# EAGLE design jit_pcb_dip (EAGLE 6.6.0)
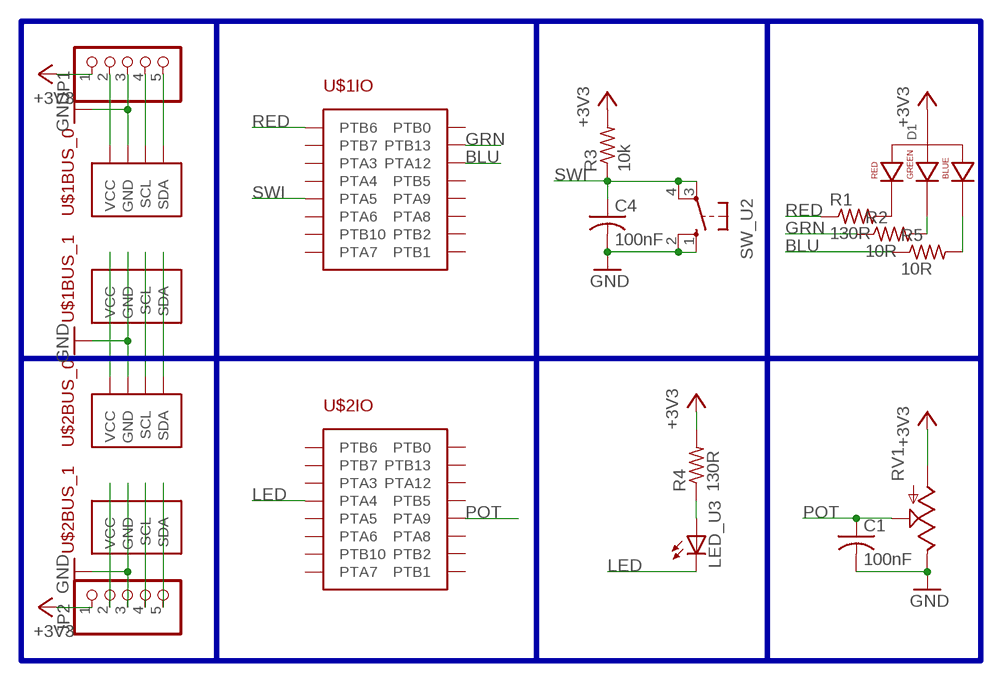
[diagram p0: schematic, sheet 1]

## Parts
C1  100nF  C-US025-025X050  [C025-025X050]
C4  100nF  C-US025-025X050  [C025-025X050]
D1  LED-RGB-CA-THRUDIFFUSE  [LED-RGB-THRU]
JP1  PINHD-1X5  [1X05]
JP2  PINHD-1X5  [1X05]
LED_U3  LED5MM  [LED5MM]
R1  130R  R-US_0204/7  [0204/7]
R2  10R  R-US_0204/7  [0204/7]
R3  10k  R-US_0204/7  [0204/7]
R4  130R  R-US_0204/7  [0204/7]
R5  10R  R-US_0204/7  [0204/7]
RV1  POT100K_3362U  [3362U]
SW_U2  10-XX  [B3F-10XX]
U$1  MODROB_CARRIER-DIP  [CARRIER_DIP]
U$2  MODROB_CARRIER-DIP  [CARRIER_DIP]

## Nets
+3V3: D1.2(ANODE) JP1.1 JP2.1 R3.2 R4.2 RV1.P$3(A)
BLU: R5.1 U$1.PTA12(IO:PTA12)
GND: C1.2 C4.2 JP1.3 JP2.3 RV1.P$1(E) SW_U2.1(S) SW_U2.2(S1) U$1.GND_0(BUS_0:GND) U$1.GND_1(BUS_1:GND) U$2.GND_0(BUS_0:GND) U$2.GND_1(BUS_1:GND)
GRN: R2.1 U$1.PTB13(IO:PTB13)
LED: LED_U3.K(C) U$2.PTA4(IO:PTA4)
N$1: JP1.2 U$1.VCC_0(BUS_0:VCC)
N$2: U$1.VCC_1(BUS_1:VCC) U$2.VCC_0(BUS_0:VCC)
N$3: JP1.4 U$1.SCL_0(BUS_0:SCL)
N$4: LED_U3.A R4.1
N$5: JP1.5 U$1.SDA_0(BUS_0:SDA)
N$6: JP2.2 U$2.VCC_1(BUS_1:VCC)
N$7: U$1.SCL_1(BUS_1:SCL) U$2.SCL_0(BUS_0:SCL)
N$8: U$1.SDA_1(BUS_1:SDA) U$2.SDA_0(BUS_0:SDA)
N$9: JP2.4 U$2.SCL_1(BUS_1:SCL)
N$10: JP2.5 U$2.SDA_1(BUS_1:SDA)
N$13: D1.1(RED_CATHODE) R1.2
N$14: D1.3(GREEN_CATHODE) R2.2
N$15: D1.4(BLUE_CATHODE) R5.2
POT: C1.1 RV1.P$2(S) U$2.PTA9(IO:PTA9)
RED: R1.1 U$1.PTB6(IO:PTB6)
SWI: C4.1 R3.1 SW_U2.3(P) SW_U2.4(P1) U$1.PTA5(IO:PTA5)
Unconnected: U$1.PTA3(IO:PTA3) U$1.PTA4(IO:PTA4) U$1.PTA6(IO:PTA6) U$1.PTA7(IO:PTA7) U$1.PTA8(IO:PTA8) U$1.PTA9(IO:PTA9) U$1.PTB0(IO:PTB0) U$1.PTB1(IO:PTB1) U$1.PTB2(IO:PTB2) U$1.PTB5(IO:PTB5) U$1.PTB7(IO:PTB7) U$1.PTB10(IO:PTB10) U$2.PTA3(IO:PTA3) U$2.PTA5(IO:PTA5) U$2.PTA6(IO:PTA6) U$2.PTA7(IO:PTA7) U$2.PTA8(IO:PTA8) U$2.PTA12(IO:PTA12) U$2.PTB0(IO:PTB0) U$2.PTB1(IO:PTB1) U$2.PTB2(IO:PTB2) U$2.PTB5(IO:PTB5) U$2.PTB6(IO:PTB6) U$2.PTB7(IO:PTB7) U$2.PTB10(IO:PTB10) U$2.PTB13(IO:PTB13)

## Buses
B$1

## Library data of the parts
C1 C4 = rcl:C-US: CAPACITOR, American symbol
D1 = modular_robotics:LED-RGB-CA-THRU: RGB Through-hole common anode SparkFun store front COM-10821 (diffuse) COM-10820 (clear); PROD_ID: DIO-10632
JP1 JP2 = pinhead:PINHD-1X5: PIN HEADER
LED_U3 = led:LED: LED OSRAM: - CHIPLED LG R971, LG N971, LY N971, LG Q971, LY Q971, LO R971, LY R971 LH N974, LH R974 LS Q976, LO Q976, LY Q976 LO Q996 - Hyper CHIPLED LW Q18S LB Q993, LB Q99A, LB R99A - SideLED LS A670, LO A670, LY A670, LG A670, LP A670 LB A673, LV A673, LT A673, LW A673 LH A674 LY A675 LS A676, LA A676, LO A676, LY A676, LW A676 LS A679, LY A679, LG A679 - Hyper Micro SIDELED® LS Y876, LA Y876, LO Y876, LY Y876 LT Y87S - SmartLED LW L88C, LW L88S LB L89C, LB L89S, LG L890 LS L89K, LO L89K, LY L89K LS L896, LA L896, LO L896, LY L896 - TOPLED LS T670, LO T670, LY T670, LG T670, LP T670 LSG T670, LSP T670, LSY T670, LOP T670, LYG T670 LG T671, LOG T671, LSG T671 LB T673, LV T673, LT T673, LW T673 LH T674 LS T676, LA T676, LO T676, LY T676, LB T676, LH T676, LSB T676, LW T676 LB T67C, LV T67C, LT T67C, LS T67K, LO T67K, LY T67K, LW E67C LS E67B, LA E67B, LO E67B, LY E67B, LB E67C, LV E67C, LT E67C LW T67C LS T679, LY T679, LG T679 LS T770, LO T770, LY T770, LG T770, LP T770 LB T773, LV T773, LT T773, LW T773 LH T774 LS E675, LA E675, LY E675, LS T675 LS T776, LA T776, LO T776, LY T776, LB T776 LHGB T686 LT T68C, LB T68C - Hyper Mini TOPLED® LB M676 - Mini TOPLED Santana® LG M470 LS M47K, LO M47K, LY M47K Source: http://www.osram.convergy.de LUXEON: - LUMILED® LXK2-PW12-R00, LXK2-PW12-S00, LXK2-PW14-U00, LXK2-PW14-V00 LXK2-PM12-R00, LXK2-PM12-S00, LXK2-PM14-U00 LXK2-PE12-Q00, LXK2-PE12-R00, LXK2-PE12-S00, LXK2-PE14-T00, LXK2-PE14-U00 LXK2-PB12-K00, LXK2-PB12-L00, LXK2-PB12-M00, LXK2-PB14-N00, LXK2-PB14-P00, LXK2-PB14-Q00 LXK2-PR12-L00, LXK2-PR12-M00, LXK2-PR14-Q00, LXK2-PR14-R00 LXK2-PD12-Q00, LXK2-PD12-R00, LXK2-PD12-S00 LXK2-PH12-R00, LXK2-PH12-S00 LXK2-PL12-P00, LXK2-PL12-Q00, LXK2-PL12-R00 Source: www.luxeon.com KINGBRIGHT: KA-3528ASYC Source: www.kingbright.com
R1-R5 = rcl:R-US_: RESISTOR, American symbol
RV1 = SparkFun-Electromechanical:POT
SW_U2 = switch-omron:10-XX: OMRON SWITCH; MPN: B3F-1000; OC_FARNELL: 176432; OC_NEWARK: 36M3542
U$1 U$2 = modular_robotics:MODROB_CARRIER

## Board
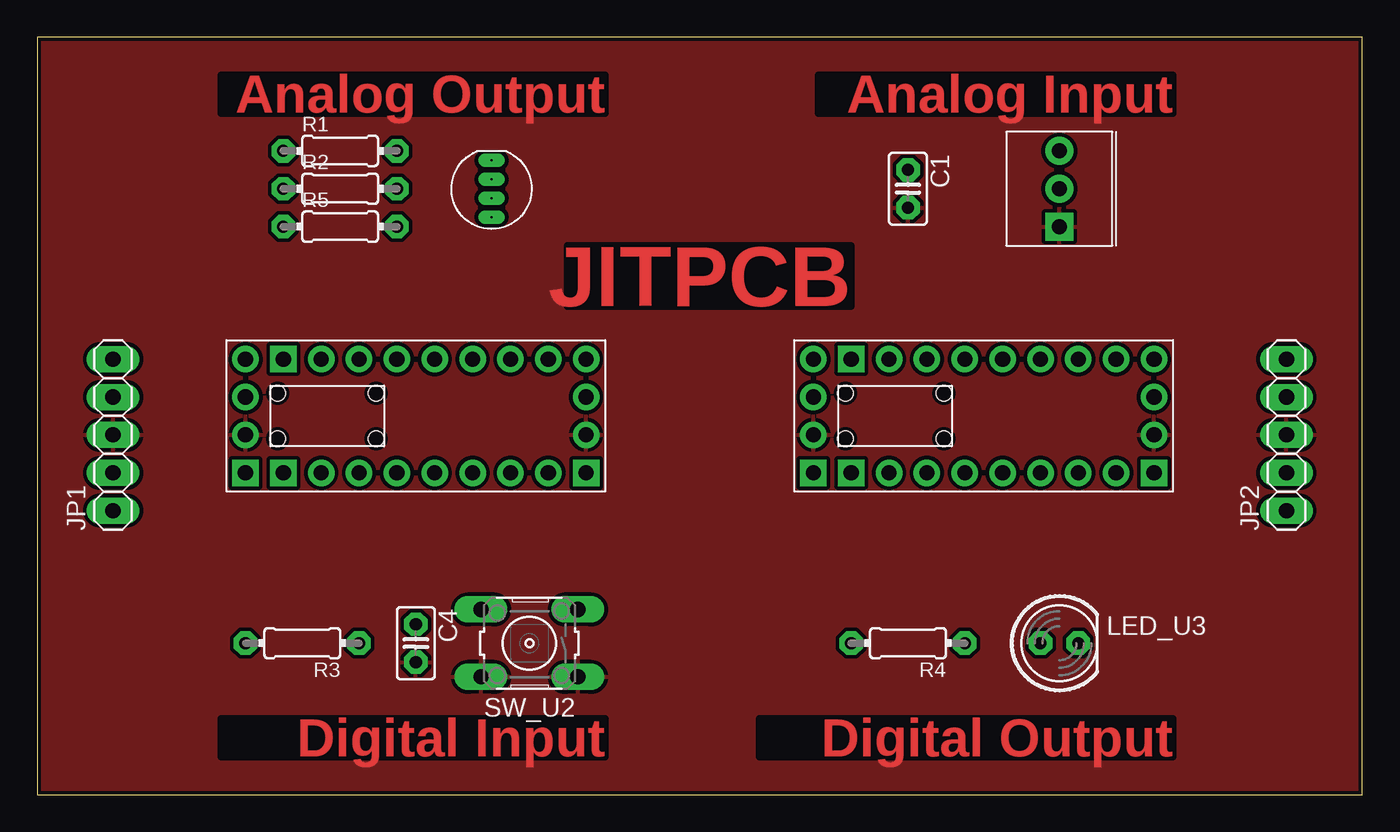
[diagram p1: board, top side]
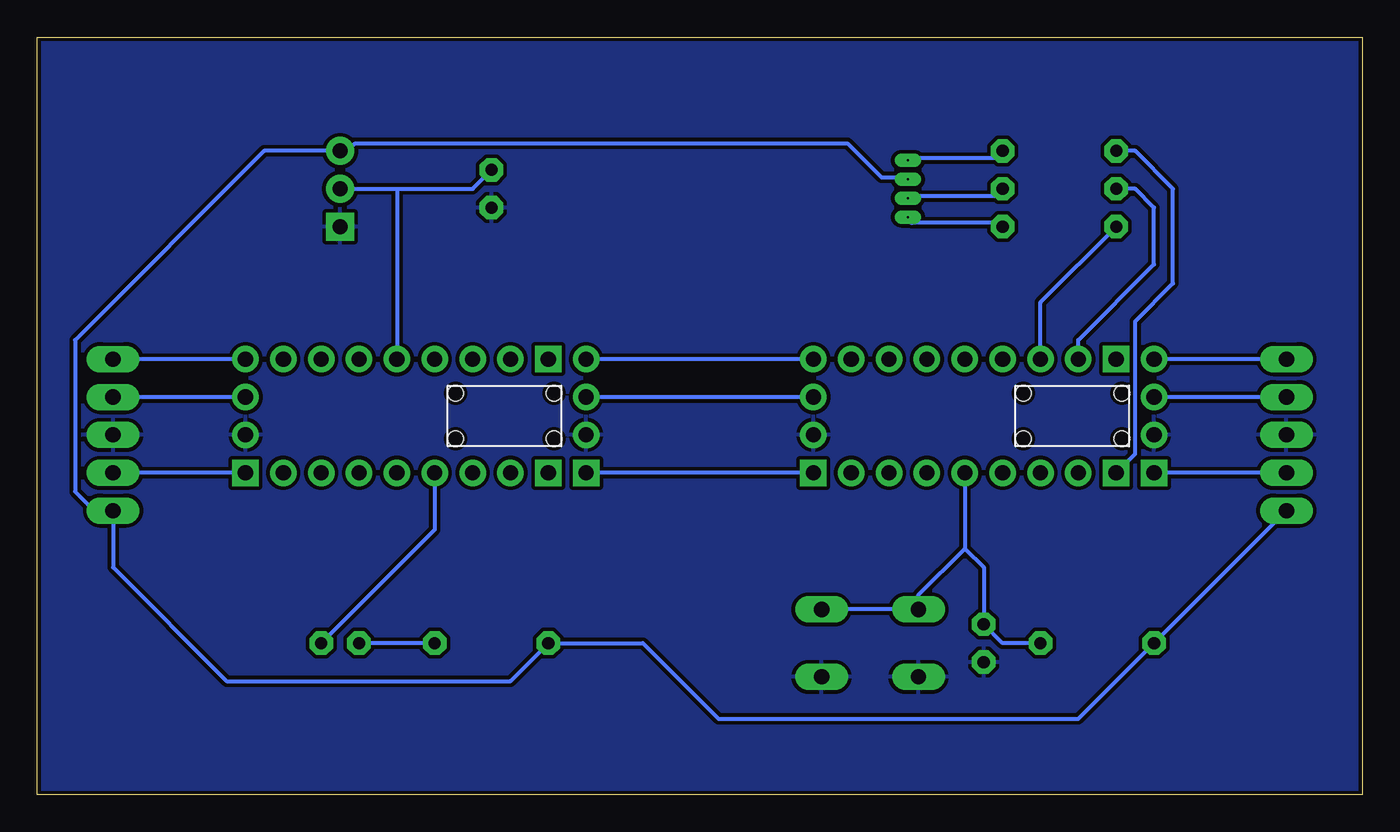
[diagram p2: board, bottom side, seen from below]

Size 88.9 x 50.8 mm. Coordinates in mm from the lower left corner, seen from the top.
Outline: 88.9,0 88.9,50.8 0,50.8 0,0 88.9,0
Copper layers (1*16): Top 0.035mm / dielectric 1.5mm / Bottom 0.035mm
Design rules "default *": minimum track width 10mil, minimum drill 24mil, track to track 10mil, track to pad 10mil, pad to pad 10mil, via to via 10mil, smd to smd 10mil, copper to edge 10mil, drill to drill 8mil, minimum pad ring 15mil, minimum via ring 10mil, stop-mask expansion 4mil, vias tented up to drill 0mil, thermal gap 10mil
Holes 1.02 mm at 16.13,23.88 16.13,26.92 22.73,23.88 22.73,26.92 54.23,23.88 54.23,26.92 60.83,23.88 60.83,26.92

### Footprints (pad centres in the part's own frame; a part is rotated, then mirrored left to right if it is on the bottom)
C025-025X050 = drill 0.813 octagon: 1 -1.27,0; 2 1.27,0
LED-RGB-THRU = drill 0.127 long: 1 1.905,0; 2 0.635,0; 3 -0.635,0; 4 -1.905,0
1X05 = drill 1.016 long: 1 -5.08,0; 2 -2.54,0; 3 0,0; 4 2.54,0; 5 5.08,0
LED5MM = drill 0.813 octagon: A -1.27,0; K 1.27,0
0204/7 = drill 0.813 octagon: 1 -3.81,0; 2 3.81,0
3362U = drill 1.016 pad 1.88 square: P$1 0,2.54 | drill 1.016 pad 1.88: P$2 2.54,2.54; P$3 5.08,2.54
B3F-10XX = drill 1.016 long: 1 -3.251,2.261; 2 3.251,2.261; 3 -3.251,-2.261; 4 3.251,-2.261
CARRIER_DIP = drill 1.016: GND_0 -11.43,-1.27; GND_1 11.43,-1.27; PTA3 -3.81,-3.81; PTA4 -1.27,-3.81; PTA5 1.27,-3.81; PTA6 3.81,-3.81; PTA7 8.89,-3.81; PTA8 3.81,3.81; PTA9 1.27,3.81; PTA12 -3.81,3.81; PTB1 8.89,3.81; PTB2 6.35,3.81; PTB5 -1.27,3.81; PTB7 -6.35,-3.81; PTB10 6.35,-3.81; PTB13 -6.35,3.81; SCL_0 -11.43,1.27; SCL_1 11.43,1.27; SDA_0 -11.43,3.81; SDA_1 11.43,3.81 | drill 1.016 square: PTB0 -8.89,3.81; PTB6 -8.89,-3.81; VCC_0 -11.43,-3.81; VCC_1 11.43,-3.81

### Placement (x,y rotation side)
C1  58.42,40.64 270 top
C4  25.4,10.16 270 top
D1  30.48,40.64 90 top
JP1  5.08,24.13 90 top
JP2  83.82,24.13 90 top
LED_U3  68.58,10.16 0 top
R1  20.32,43.18 0 top
R2  20.32,40.64 0 top
R3  17.78,10.16 180 top
R4  58.42,10.16 180 top
R5  20.32,38.1 0 top
RV1  71.12,38.1 90 top
SW_U2  33.02,10.16 180 top
U$1  25.4,25.4 0 top
U$2  63.5,25.4 0 top

### Tracks (layer width: path | path; a pad name or v marks a point on that pad's centre or on a via)
+3V3
  Bottom 0.254: D1.2 30.48,41.4 32.26,41.4 34.54,43.69 67.56,43.69 68.07,43.18 RV1.P$3 73.66,43.18 86.36,30.48 86.36,20.32 85.09,19.05 JP2.1 83.82,15.24 76.2,7.62 57.15,7.62 R4.2 48.26,10.16 43.18,5.08 19.05,5.08 R3.2 JP1.1
BLU
  Bottom 0.254: U$1.PTA12 21.59,33.02 R5.1
GND
  pour Bottom (isolate 0.254): 88.9,0 88.9,50.8 0,50.8 0,0
  pour Top (isolate 0.254): 88.9,0 88.9,50.8 0,50.8 0,0
GRN
  Bottom 0.254: U$1.PTB13 19.05,30.48 13.97,35.56 13.97,39.37 15.24,40.64 R2.1
LED
  Bottom 0.254: LED_U3.K 62.23,17.78 U$2.PTA4
N$1
  Bottom 0.254: JP1.2 U$1.VCC_0
N$2
  Bottom 0.254: U$1.VCC_1 U$2.VCC_0
N$3
  Bottom 0.254: JP1.4 U$1.SCL_0
N$4
  Bottom 0.254: R4.1 LED_U3.A
N$5
  Bottom 0.254: JP1.5 U$1.SDA_0
N$6
  Bottom 0.254: U$2.VCC_1 JP2.2
N$7
  Bottom 0.254: U$1.SCL_1 U$2.SCL_0
N$8
  Bottom 0.254: U$1.SDA_1 U$2.SDA_0
N$9
  Bottom 0.254: U$2.SCL_1 JP2.4
N$10
  Bottom 0.254: U$2.SDA_1 JP2.5
N$13
  Bottom 0.254: R1.2 24.13,42.67 30.48,42.67 D1.1
N$14
  Bottom 0.254: R2.2 24.13,40.13 30.48,40.13 D1.3
N$15
  Bottom 0.254: R5.2 24.38,38.35 30.23,38.35 30.48,38.61 D1.4
POT
  Bottom 0.254: C1.1 59.69,40.64 64.77,40.64 | RV1.P$2 64.77,40.64 | 64.77,40.64 U$2.PTA9
RED
  Bottom 0.254: U$1.PTB6 15.24,22.86 15.24,31.75 12.7,34.29 12.7,40.64 15.24,43.18 R1.1
SWI
  Bottom 0.254: R3.1 24.13,10.16 C4.1 25.4,15.24 26.67,16.51 | SW_U2.3 36.07,12.45 29.97,12.45 SW_U2.4 29.77,13.41 26.67,16.51 | U$1.PTA5 26.67,16.51

### Text on the board
Top: Analog Output | Analog Input | JITPCB | Digital Input | Digital Output